# Altium schematic sheet LP_LED_CUBE_8x8x8.SchDoc
size A4
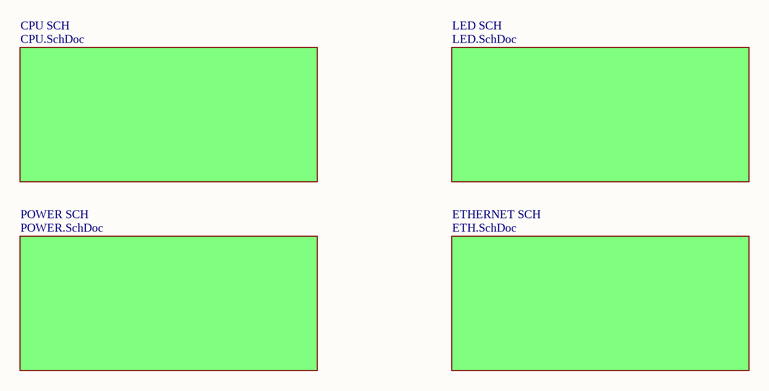
[diagram p0: LP_LED_CUBE_8x8x8.SchDoc]

## Sub-sheets
CPU SCH = CPU.SchDoc: no entries
ETHERNET SCH = ETH.SchDoc: no entries
LED SCH = LED.SchDoc: no entries
POWER SCH = POWER.SchDoc: no entries